# Altium schematic sheet pa_blank.SchDoc
size Letter; SheetNumber: 16; SheetTotal: 16
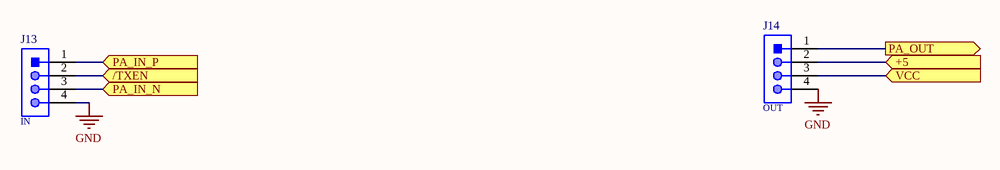
[diagram p0: pa_blank.SchDoc]

## Parts
J13  IN  [61300411121]
J14  OUT  [61300411121]

## Ports
+5 (in), /TXEN (in), PA_IN_N (in), PA_IN_P (in), PA_OUT (out), VCC (in)

## Nets
GND: J13.4 J14.4
+5: J14.2 ; port +5
/TXEN: J13.2 ; port /TXEN
PA_IN_N: J13.3 ; port PA_IN_N
PA_IN_P: J13.1 ; port PA_IN_P
PA_OUT: J14.1 ; port PA_OUT
VCC: J14.3 ; port VCC

## Library data of the parts
J13 J14 = CMP-1502-01064-1: THT Vertical Pin Header WR-PHD, Pitch 2.54 mm, Single Row, 4 pins; Manufacturer: Wurth Elektronik; Withstanding Voltage: 500VAC; Rated Current: 3A; Working Voltage: 250VAC; Pin Number: 4; Gender: Male; Contact Resistance: 20mOhm; Pitch: 2.54mm; Manufacturer URL: http://www.we-online.de; Operating Temperature: -40to105degC; Packaging: Bag; Mounting Technology: THT; Package Reference: 61300411121; Datasheet URL: https://katalog.we-online.de/em/datasheet/6130xx11121.pdf; Publisher: WurthElektronik; Part Number: 61300411121; Row Number: Single; Orientation: Vertical